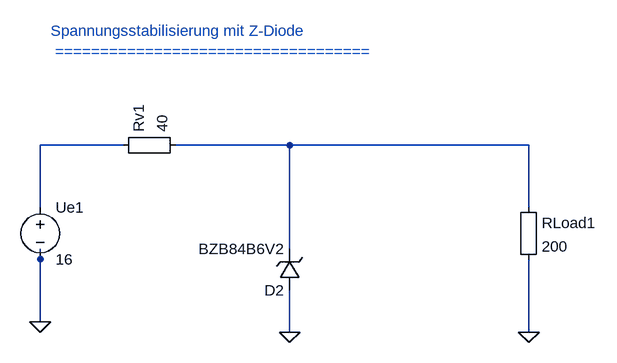
[diagram p0: schematic 5_7_2_Spannungsstabilisierung_mit_Z-Diode.asc]
5_7_2_Spannungsstabilisierung_mit_Z-Diode.asc, the LTspice schematic file:
Version 4
SHEET 1 880 680
WIRE 320 560 320 544
WIRE 704 544 704 512
WIRE 320 656 320 544
WIRE 448 384 320 384
WIRE 320 384 320 480
WIRE 1072 672 1072 560
WIRE 1072 480 1072 384
WIRE 1072 384 704 384
WIRE 704 384 528 384
WIRE 704 512 704 384
WIRE 704 608 704 672
FLAG 320 656 0
FLAG 704 672 0
FLAG 1072 672 0
FLAG 320 656 0
FLAG 704 672 0
FLAG 1072 672 0
SYMBOL voltage 320 464 R0
SYMATTR InstName Ue1
SYMATTR Value 16
SYMBOL Misc\EuropeanResistor 432 400 R270
SYMATTR InstName Rv1
SYMATTR Value 40
SYMBOL Misc\EuropeanResistor 1056 464 R0
SYMATTR InstName RLoad1
SYMATTR Value 200
SYMBOL zener 720 608 R180
SYMATTR InstName D2
SYMATTR Value BZB84B6V2
TEXT 336 208 Left 2 ;Spannungsstabilisierung mit Z-Diode \n ===================================

The netlist it stands for:
* 5_7_2_Spannungsstabilisierung_mit_Z-Diode.asc
V§Ue1 N002 0 16
Rv1 N002 N001 40
RLoad1 N001 0 200
D2 0 N001 BZB84B6V2
.model D D
.lib standard.dio
* Spannungsstabilisierung mit Z-Diode
*  ===================================
.backanno
.end